# Altium schematic sheet 0_Overview.SchDoc: Overview
size A3; DocumentNumber: 1; SheetNumber: 1; SheetTotal: 6; PageSetup: Record=PageOptions|CenterHorizontal=True|CenterVertical=True|PrintScale=1.01|XCorrection=1.00|YCorrection=1.00|PrintKind=0|BorderSize=5000000|LeftOffset=0|BottomOffset=0|Orientation=2|PaperLength=1000|PaperWidth=1000|Scale=100|PaperSource=7|PrintQuality=-4|MediaType=1|DitherType=10|PaperKind=A3|PrintScaleMode=1
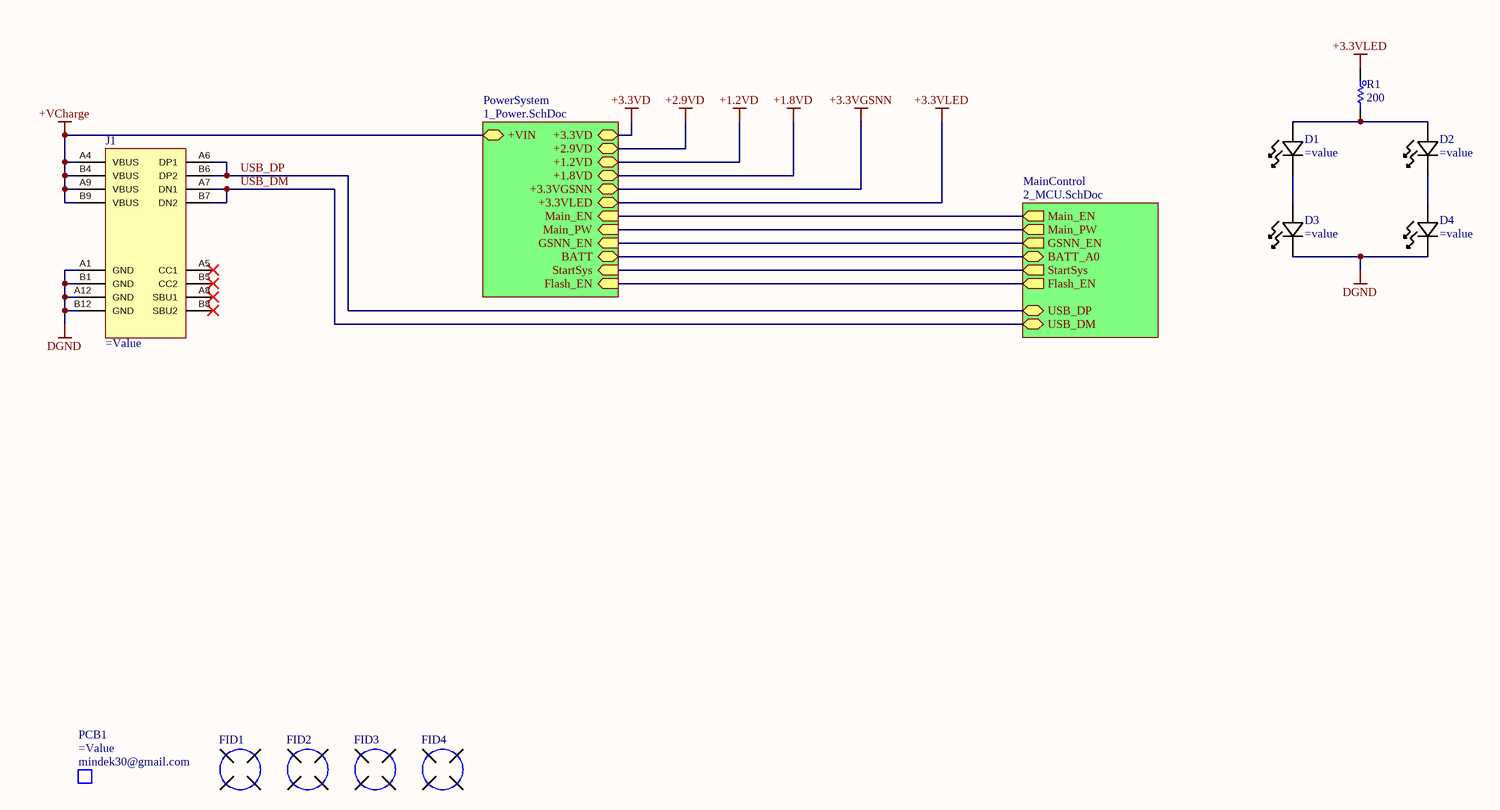
[diagram p0: 0_Overview.SchDoc]

## Parts
D1  (no value)  [LED_0VS75000_WRE]
D2  (no value)  [LED_0VS75000_WRE]
D3  (no value)  [LED_0VS75000_WRE]
D4  (no value)  [LED_0VS75000_WRE]
FID1  FIDUCIAL  [FID]  (value not drawn)  (no BOM)
FID2  FIDUCIAL  [FID]  (value not drawn)  (no BOM)
FID3  FIDUCIAL  [FID]  (value not drawn)  (no BOM)
FID4  FIDUCIAL  [FID]  (value not drawn)  (no BOM)
J1  (no value)  [2137160001_MOL_2137160001(Primary)]
PCB1  Manufacturer: mindek30@gmail.com  (mechanical)
R1  200  [R_2512]

## Sub-sheets
MainControl = 2_MCU.SchDoc: BATT_A0 (bidir), GSNN_EN (out), USB_DP (bidir), USB_DM (bidir), Main_PW (out), Main_EN (out), StartSys (out), Flash_EN (out)
PowerSystem = 1_Power.SchDoc: +3.3VD (bidir), BATT (bidir), +VIN (bidir), +3.3VGSNN (bidir), +1.8VD (bidir), +2.9VD (bidir), GSNN_EN (in), +1.2VD (bidir), Main_PW (in), Main_EN (in), StartSys (in), Flash_EN (in), +3.3VLED (bidir)

## Nets
+1.2VD: sheet PowerSystem/+1.2VD
+1.8VD: sheet PowerSystem/+1.8VD
+2.9VD: sheet PowerSystem/+2.9VD
+3.3VD: sheet PowerSystem/+3.3VD
+3.3VGSNN: sheet PowerSystem/+3.3VGSNN
+3.3VLED: R1.1 ; sheet PowerSystem/+3.3VLED
+VCharge: J1.A4(VBUS) J1.A9(VBUS) J1.B4(VBUS) J1.B9(VBUS) ; sheet PowerSystem/+VIN
DGND: D3.2 D4.2 J1.A1(GND) J1.A12(GND) J1.B1(GND) J1.B12(GND)
USB_DM: J1.A7(DN1) J1.B7(DN2) ; sheet MainControl/USB_DM
USB_DP: J1.A6(DP1) J1.B6(DP2) ; sheet MainControl/USB_DP
NetD1_1: D1.1 D2.1 R1.2
NetD1_2: D1.2 D3.1
NetD2_2: D2.2 D4.1
(unnamed): sheet MainControl/BATT_A0, sheet PowerSystem/BATT
(unnamed): sheet MainControl/GSNN_EN, sheet PowerSystem/GSNN_EN
(unnamed): sheet MainControl/Main_PW, sheet PowerSystem/Main_PW
(unnamed): sheet MainControl/Main_EN, sheet PowerSystem/Main_EN
(unnamed): sheet MainControl/StartSys, sheet PowerSystem/StartSys
(unnamed): sheet MainControl/Flash_EN, sheet PowerSystem/Flash_EN

Not connected (* = marked no-connect by the designer): J1 A5(CC1)* A8(SBU1)* B5(CC2)* B8(SBU2)*

## Notes on the sheet
- Title :
- Revision :
- ผู้จัดทำ:
- Size:
- A3
- Time:
- ผู้เขียน:
- บริษัท ยูนิเวอร์แซล ยูทีลิตี้ส์ จำกัด (มหาชน) เลขที่ 1 อาคาร อีสท์วอเตอร์ ชั้น 18 ซอยวิภาวดีรังสิต 5 แขวงจอมพล เขตจตุจักร กรุงเทพฯ 10900
  Tel : +662-272-1688
  Fax :+662-2721690-1
- -
- Sheet:
- of
- ผู้อำนวยการ
- ผู้ตรวจสอบ:
- Number:
- กรรมการผู้จัดการ:
- File:

## Library data of the parts
D1-D4 = D_LED_150060BS75000: LED BLUE CLEAR 0603 SMD; Manufacturer: Wurth Electronics; Value: 150060VS75000; PackageReference: 0603; PartID: 732-4980-1-ND; PartNumber: 150060VS75000
FID1-FID4 = FID_FIDUCIAL: Manufacturer: mindek30@gmail.com; Value2: Non SE; Value: Non SE; PartNumber: =PCB_PN+'_'+PCB_Rev; PartID: =PCB_Rev; PackageReference: Non SE; Value3: Non SE
J1 = CON_USBC: CONN RCPT USB2.0 TYPE C 24POS RA; PartNumber: 2137160001; Manufacturer: Molex; Value: 2137160001; PartID: 900-2137160001CT-ND; PackageReference: *; Value2: *; Value3: *
PCB1 = PCB_Bare: BARE PCB; PartNumber: =PCB_PN+'_'+PCB_Rev; PackageReference: Non SE; PartID: =PCB_Rev; Value2: =JobFile_Title; Value: =PartNumber; Value3: =PCBA_PN+'_'+PCBA_Rev
R1 = R_Resister: Resistor; Manufacturer: Vishay; PartNumber: EXB-2HV472JV; Value: 200; PackageReference: 0603; PartID: *; Value2: *; Value3: *